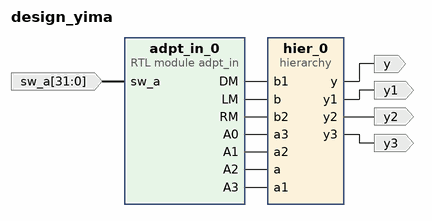
[diagram p0: block diagram of the top level]
# Vivado block design design_yima, xc7z020clg400-1, Vivado 2024.2
create_bd_design design_yima

create_bd_port -dir I -from 31 -to 0 sw_a
create_bd_port -dir O y
create_bd_port -dir O y1
create_bd_port -dir O y2
create_bd_port -dir O y3

create_bd_cell -type module -reference adpt_in adpt_in_0
create_bd_cell -type hier hier_0

# ---- hierarchy /hier_0 ----
current_bd_instance /hier_0
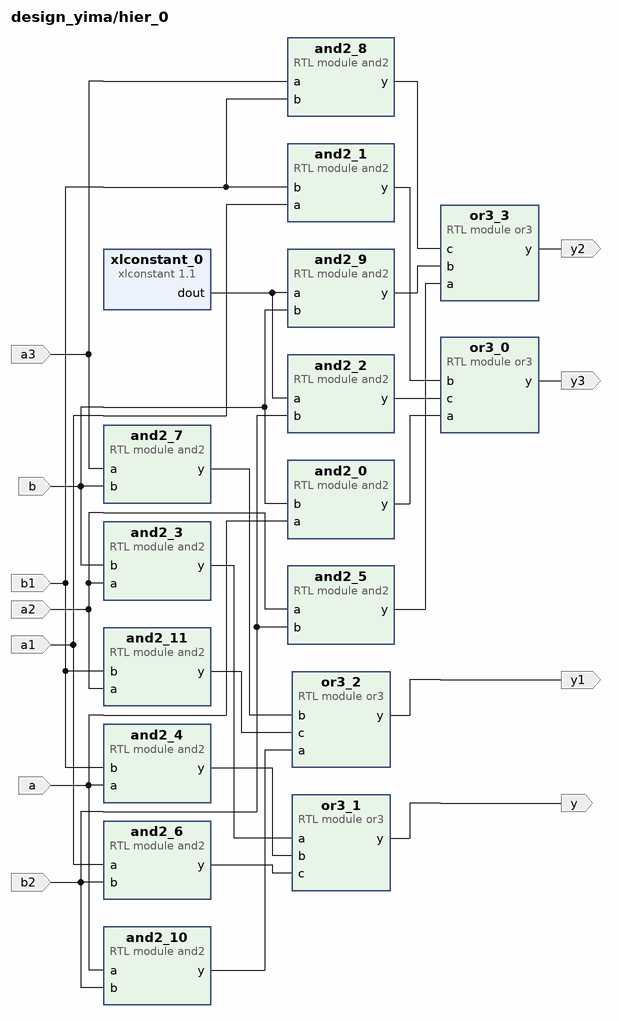
[diagram p1: block diagram inside /hier_0]
create_bd_pin -dir O y
create_bd_pin -dir O y1
create_bd_pin -dir I a
create_bd_pin -dir I b
create_bd_pin -dir I a1
create_bd_pin -dir I b1
create_bd_pin -dir O y2
create_bd_pin -dir I b2
create_bd_pin -dir I a2
create_bd_pin -dir I a3
create_bd_pin -dir O y3

create_bd_cell -type module -reference or3 or3_1
create_bd_cell -type module -reference or3 or3_2
create_bd_cell -type module -reference and2 and2_0
create_bd_cell -type module -reference and2 and2_1
create_bd_cell -type module -reference or3 or3_3
create_bd_cell -type ip -vlnv xilinx.com:ip:xlconstant:1.1 xlconstant_0
set_property -dict {CONFIG.CONST_VAL 0} [get_bd_cells xlconstant_0]
create_bd_cell -type module -reference and2 and2_2
create_bd_cell -type module -reference and2 and2_3
create_bd_cell -type module -reference and2 and2_4
create_bd_cell -type module -reference and2 and2_10
create_bd_cell -type module -reference and2 and2_5
create_bd_cell -type module -reference and2 and2_11
create_bd_cell -type module -reference and2 and2_6
create_bd_cell -type module -reference and2 and2_7
create_bd_cell -type module -reference and2 and2_8
create_bd_cell -type module -reference and2 and2_9
create_bd_cell -type module -reference or3 or3_0

# ---- connections ----

current_bd_instance /hier_0
connect_bd_net -net adpt_in_0_DM [get_bd_pins b1] [get_bd_pins and2_4/b] [get_bd_pins and2_11/b] [get_bd_pins and2_8/b] [get_bd_pins and2_1/b]
connect_bd_net -net adpt_in_0_LM [get_bd_pins b] [get_bd_pins and2_3/b] [get_bd_pins and2_7/b] [get_bd_pins and2_9/b] [get_bd_pins and2_0/b]
connect_bd_net -net adpt_in_0_RM [get_bd_pins b2] [get_bd_pins and2_6/b] [get_bd_pins and2_10/b] [get_bd_pins and2_5/b] [get_bd_pins and2_2/b]
connect_bd_net -net adpt_in_0_a0 [get_bd_pins a3] [get_bd_pins and2_8/a] [get_bd_pins and2_7/a]
connect_bd_net -net adpt_in_0_a1 [get_bd_pins a2] [get_bd_pins and2_11/a] [get_bd_pins and2_5/a] [get_bd_pins and2_3/a]
connect_bd_net -net adpt_in_0_a2 [get_bd_pins a] [get_bd_pins and2_4/a] [get_bd_pins and2_10/a] [get_bd_pins and2_0/a]
connect_bd_net -net adpt_in_0_a3 [get_bd_pins a1] [get_bd_pins and2_6/a] [get_bd_pins and2_1/a]
connect_bd_net [get_bd_pins and2_0/y] [get_bd_pins or3_0/a]
connect_bd_net [get_bd_pins and2_10/y] [get_bd_pins or3_2/a]
connect_bd_net [get_bd_pins and2_11/y] [get_bd_pins or3_2/c]
connect_bd_net [get_bd_pins and2_1/y] [get_bd_pins or3_0/b]
connect_bd_net [get_bd_pins and2_2/y] [get_bd_pins or3_0/c]
connect_bd_net [get_bd_pins and2_3/y] [get_bd_pins or3_1/a]
connect_bd_net [get_bd_pins and2_4/y] [get_bd_pins or3_1/b]
connect_bd_net [get_bd_pins and2_5/y] [get_bd_pins or3_3/a]
connect_bd_net [get_bd_pins and2_6/y] [get_bd_pins or3_1/c]
connect_bd_net [get_bd_pins and2_7/y] [get_bd_pins or3_2/b]
connect_bd_net [get_bd_pins and2_8/y] [get_bd_pins or3_3/c]
connect_bd_net [get_bd_pins and2_9/y] [get_bd_pins or3_3/b]
connect_bd_net [get_bd_pins or3_0/y] [get_bd_pins y3]
connect_bd_net [get_bd_pins or3_1/y] [get_bd_pins y]
connect_bd_net [get_bd_pins or3_2/y] [get_bd_pins y1]
connect_bd_net [get_bd_pins or3_3/y] [get_bd_pins y2]
connect_bd_net [get_bd_pins xlconstant_0/dout] [get_bd_pins and2_2/a] [get_bd_pins and2_9/a]

current_bd_instance /
connect_bd_net [get_bd_pins adpt_in_0/DM] [get_bd_pins hier_0/b1]
connect_bd_net [get_bd_pins adpt_in_0/LM] [get_bd_pins hier_0/b]
connect_bd_net [get_bd_pins adpt_in_0/RM] [get_bd_pins hier_0/b2]
connect_bd_net [get_bd_pins adpt_in_0/A0] [get_bd_pins hier_0/a3]
connect_bd_net [get_bd_pins adpt_in_0/A1] [get_bd_pins hier_0/a2]
connect_bd_net [get_bd_pins adpt_in_0/A2] [get_bd_pins hier_0/a]
connect_bd_net [get_bd_pins adpt_in_0/A3] [get_bd_pins hier_0/a1]
connect_bd_net -net cg_fpga_0_gpio_sw_2 [get_bd_ports sw_a] [get_bd_pins adpt_in_0/sw_a]
connect_bd_net -net or3_0_y [get_bd_pins hier_0/y3] [get_bd_ports y3]
connect_bd_net -net or3_1_y [get_bd_pins hier_0/y] [get_bd_ports y]
connect_bd_net -net or3_2_y [get_bd_pins hier_0/y1] [get_bd_ports y1]
connect_bd_net -net or3_3_y [get_bd_pins hier_0/y2] [get_bd_ports y2]

validate_bd_design
save_bd_design
